# Altium schematic sheet PowerSplitter.SchDoc
size A4; SheetNumber: 1; SheetTotal: 1
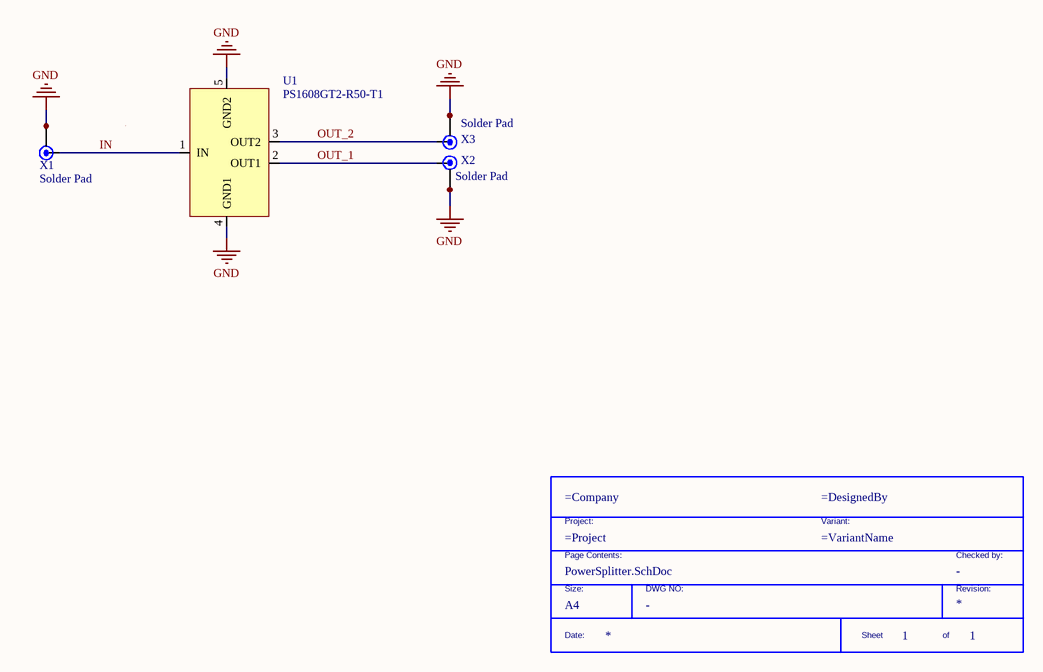
[diagram p0: PowerSplitter.SchDoc]

## Parts
*  Size: A4  (hidden comment: TitleBlock)  (graphical)
U1  PS1608GT2-R50-T1  [PS1608GT2-R50-T1]
X1  Solder Pad  [CPW Edge Connector]
X2  Solder Pad  [CPW Edge Connector]
X3  Solder Pad  [CPW Edge Connector]

## Nets
GND: U1.4(GND1) U1.5(GND2) X1.2 X1.3 X2.2 X2.3 X3.2 X3.3
IN: U1.1(IN) X1.1
OUT_1: U1.2(OUT1) X2.1
OUT_2: U1.3(OUT2) X3.1

## Notes on the sheet
- (in symbol TitleBlock) Project:; Variant:; Page Contents:; Checked by:; Size:; DWG NO:; Revision:; Date:; Sheet; of

## Library data of the parts
* = TitleBlock: Standard Title Block; DWG NO: -; Checked by: -
U1 = PS1608GT2-R50-T1: Splitter, 0MHz Min, 20000MHz Max, 6dB Insertion Loss-Max; Manufacturer: Susumu; Characteristic Impedance: 50R; Operating Frequency-Max: 20GHz; VSWR-Max: 1.5; Supplier: Digikey; Supplier Part Number: 408-2049-1-ND; Manufacturer Part Number: PS1608GT2-R50-T1; RoHS: Yes; Category: Chip SMD Resistors; Stock: 9749; Pricing: 1=2.27, 10=1.571, 50=1.1856, 100=1.0413, 500=0.875 (USD); Terminal Finish: Tin; JESD-609 Code: e3; Construction: COMPONENT; Operating Frequency-Min: 0MHz; RF/Microwave Device Type: SPLITTER; Reach SVHC Compliant: Yes; RoHS Compliant: Yes; ComponentLink1URL: https://datasheet.ciiva.com:443/pdfs/VipMasterIC/IC/SUSU/SUSU-S-A0009163549/SUSU-S-A0009163549-1.pdf?src-supplier=IHS+Markit; ComponentLink1Description: https://datasheet.ciiva.com:443/pdfs/VipMasterIC/IC/SUSU/SUSU-S-A0009163549/SUSU-S-A0009163549-1.pdf?src-supplier=IHS+Markit; ComponentLink2URL: http://www.susumu.co.jp/common/pdf/n_catalog_partition31_en.pdf?src-supplier=Digikey; ComponentLink2Description: http://www.susumu.co.jp/common/pdf/n_catalog_partition31_en.pdf?src-supplier=Digikey
X1-X3 = RF  CPW Solder Pad: Solder pad for RF Coplanar Waveguide Rogers 4350B Thickness 0.020" Copper 1oz